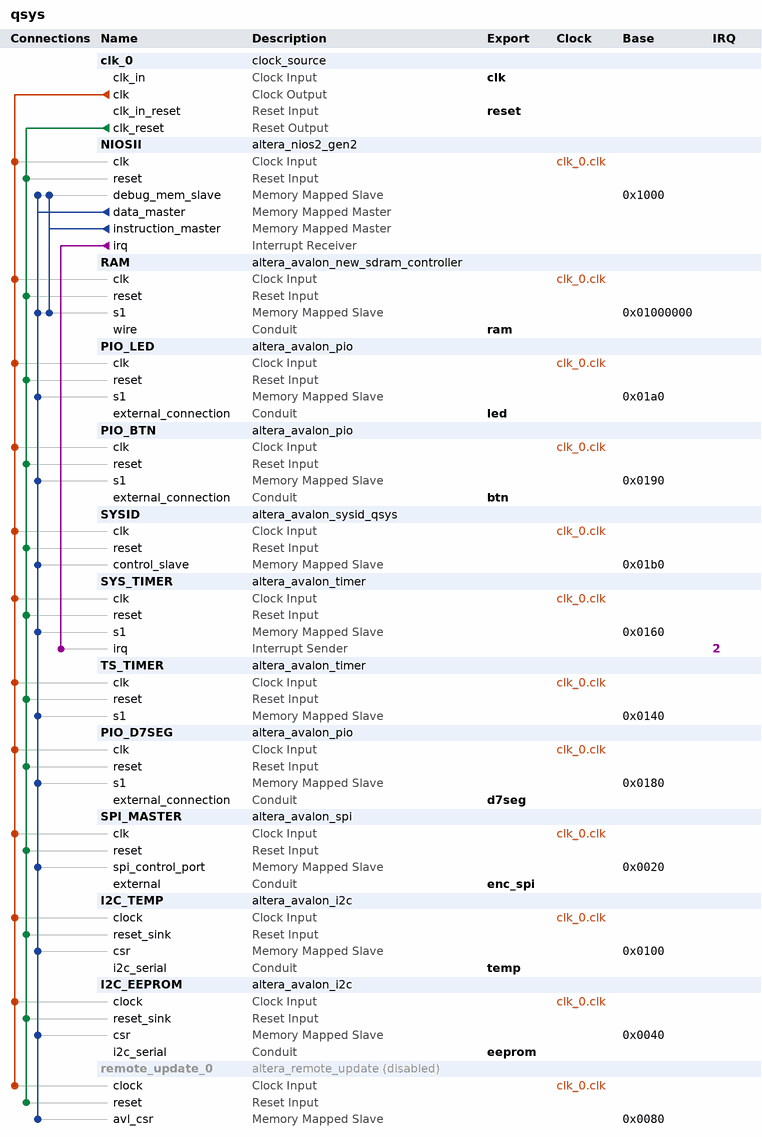
[diagram p0: system contents]
# Platform Designer (Qsys) system qsys, Cyclone IV E EP4CE6E22C8
# Parameters at their usual value, and those the tool derives, are not listed.
package require -exact qsys 20.1
create_system qsys
set_project_property DEVICE_FAMILY {Cyclone IV E}
set_project_property DEVICE EP4CE6E22C8

add_instance clk_0 clock_source 20.1
set_instance_parameter_value clk_0 clockFrequency 25000000

add_instance NIOSII altera_nios2_gen2 20.1
set_instance_parameter_value NIOSII dcache_size 0
set_instance_parameter_value NIOSII dividerType srt2
set_instance_parameter_value NIOSII exceptionSlave RAM.s1
set_instance_parameter_value NIOSII icache_size 0
set_instance_parameter_value NIOSII impl Tiny
set_instance_parameter_value NIOSII resetSlave RAM.s1

add_instance RAM altera_avalon_new_sdram_controller 20.1
set_instance_parameter_value RAM TAC 5.4
set_instance_parameter_value RAM TRCD 20.0
set_instance_parameter_value RAM TRP 20.0
set_instance_parameter_value RAM casLatency 2
set_instance_parameter_value RAM columnWidth 8
set_instance_parameter_value RAM dataWidth 16
set_instance_parameter_value RAM generateSimulationModel false
set_instance_parameter_value RAM model single_Micron_MT48LC4M32B2_7_chip
set_instance_parameter_value RAM numberOfBanks 4
set_instance_parameter_value RAM numberOfChipSelects 1
set_instance_parameter_value RAM powerUpDelay 100.0
set_instance_parameter_value RAM refreshPeriod 31.25
set_instance_parameter_value RAM rowWidth 12

add_instance PIO_LED altera_avalon_pio 20.1
set_instance_parameter_value PIO_LED direction Output
set_instance_parameter_value PIO_LED width 4

add_instance PIO_BTN altera_avalon_pio 20.1
set_instance_parameter_value PIO_BTN bitClearingEdgeCapReg true
set_instance_parameter_value PIO_BTN captureEdge true
set_instance_parameter_value PIO_BTN direction Input
set_instance_parameter_value PIO_BTN edgeType FALLING
set_instance_parameter_value PIO_BTN generateIRQ true
set_instance_parameter_value PIO_BTN irqType EDGE
set_instance_parameter_value PIO_BTN width 8

add_instance SYSID altera_avalon_sysid_qsys 20.1
set_instance_parameter_value SYSID id 233492483

add_instance SYS_TIMER altera_avalon_timer 20.1
set_instance_parameter_value SYS_TIMER period 10
set_instance_parameter_value SYS_TIMER periodUnits MSEC

add_instance TS_TIMER altera_avalon_timer 20.1
set_instance_parameter_value TS_TIMER period 100
set_instance_parameter_value TS_TIMER periodUnits USEC

add_instance PIO_D7SEG altera_avalon_pio 20.1
set_instance_parameter_value PIO_D7SEG direction Output
set_instance_parameter_value PIO_D7SEG width 16

add_instance SPI_MASTER altera_avalon_spi 20.1
set_instance_parameter_value SPI_MASTER clockPolarity 0
set_instance_parameter_value SPI_MASTER dataWidth 8
set_instance_parameter_value SPI_MASTER masterSPI true
set_instance_parameter_value SPI_MASTER numberOfSlaves 1
set_instance_parameter_value SPI_MASTER targetClockRate 20000000

add_instance I2C_TEMP altera_avalon_i2c 20.1
set_instance_parameter_value I2C_TEMP FIFO_DEPTH 8

add_instance I2C_EEPROM altera_avalon_i2c 20.1
set_instance_parameter_value I2C_EEPROM FIFO_DEPTH 8

add_instance remote_update_0 altera_remote_update 20.1
set_instance_property remote_update_0 ENABLED false
set_instance_parameter_value remote_update_0 CBX_AUTO_BLACKBOX ALL
set_instance_parameter_value remote_update_0 DEVICE EP4CE6E22C8
set_instance_parameter_value remote_update_0 GUI_config_device EPCS16
set_instance_parameter_value remote_update_0 check_app_pof false
set_instance_parameter_value remote_update_0 check_avalon_interface true
set_instance_parameter_value remote_update_0 m_support_write_config_check false
set_instance_parameter_value remote_update_0 operation_mode REMOTE

# connections
add_connection clk_0.clk I2C_EEPROM.clock clock
add_connection clk_0.clk I2C_TEMP.clock clock
add_connection clk_0.clk NIOSII.clk clock
add_connection clk_0.clk PIO_BTN.clk clock
add_connection clk_0.clk PIO_D7SEG.clk clock
add_connection clk_0.clk PIO_LED.clk clock
add_connection clk_0.clk RAM.clk clock
add_connection clk_0.clk remote_update_0.clock clock
add_connection clk_0.clk SPI_MASTER.clk clock
add_connection clk_0.clk SYS_TIMER.clk clock
add_connection clk_0.clk SYSID.clk clock
add_connection clk_0.clk TS_TIMER.clk clock
add_connection clk_0.clk_reset I2C_EEPROM.reset_sink reset
add_connection clk_0.clk_reset I2C_TEMP.reset_sink reset
add_connection clk_0.clk_reset NIOSII.reset reset
add_connection clk_0.clk_reset PIO_BTN.reset reset
add_connection clk_0.clk_reset PIO_D7SEG.reset reset
add_connection clk_0.clk_reset PIO_LED.reset reset
add_connection clk_0.clk_reset RAM.reset reset
add_connection clk_0.clk_reset remote_update_0.reset reset
add_connection clk_0.clk_reset SPI_MASTER.reset reset
add_connection clk_0.clk_reset SYS_TIMER.reset reset
add_connection clk_0.clk_reset SYSID.reset reset
add_connection clk_0.clk_reset TS_TIMER.reset reset
add_connection NIOSII.data_master I2C_EEPROM.csr avalon
set_connection_parameter_value NIOSII.data_master/I2C_EEPROM.csr baseAddress 0x0040
add_connection NIOSII.data_master I2C_TEMP.csr avalon
set_connection_parameter_value NIOSII.data_master/I2C_TEMP.csr baseAddress 0x0100
add_connection NIOSII.data_master NIOSII.debug_mem_slave avalon
set_connection_parameter_value NIOSII.data_master/NIOSII.debug_mem_slave baseAddress 0x1000
add_connection NIOSII.data_master PIO_BTN.s1 avalon
set_connection_parameter_value NIOSII.data_master/PIO_BTN.s1 baseAddress 0x0190
add_connection NIOSII.data_master PIO_D7SEG.s1 avalon
set_connection_parameter_value NIOSII.data_master/PIO_D7SEG.s1 baseAddress 0x0180
add_connection NIOSII.data_master PIO_LED.s1 avalon
set_connection_parameter_value NIOSII.data_master/PIO_LED.s1 baseAddress 0x01a0
add_connection NIOSII.data_master RAM.s1 avalon
set_connection_parameter_value NIOSII.data_master/RAM.s1 baseAddress 0x01000000
add_connection NIOSII.data_master remote_update_0.avl_csr avalon
set_connection_parameter_value NIOSII.data_master/remote_update_0.avl_csr baseAddress 0x0080
add_connection NIOSII.data_master SPI_MASTER.spi_control_port avalon
set_connection_parameter_value NIOSII.data_master/SPI_MASTER.spi_control_port baseAddress 0x0020
add_connection NIOSII.data_master SYS_TIMER.s1 avalon
set_connection_parameter_value NIOSII.data_master/SYS_TIMER.s1 baseAddress 0x0160
add_connection NIOSII.data_master SYSID.control_slave avalon
set_connection_parameter_value NIOSII.data_master/SYSID.control_slave baseAddress 0x01b0
add_connection NIOSII.data_master TS_TIMER.s1 avalon
set_connection_parameter_value NIOSII.data_master/TS_TIMER.s1 baseAddress 0x0140
add_connection NIOSII.instruction_master NIOSII.debug_mem_slave avalon
set_connection_parameter_value NIOSII.instruction_master/NIOSII.debug_mem_slave baseAddress 0x1000
add_connection NIOSII.instruction_master RAM.s1 avalon
set_connection_parameter_value NIOSII.instruction_master/RAM.s1 baseAddress 0x01000000
add_connection NIOSII.irq SYS_TIMER.irq interrupt
set_connection_parameter_value NIOSII.irq/SYS_TIMER.irq irqNumber 2

# exported interfaces
add_interface btn conduit end
set_interface_property btn EXPORT_OF PIO_BTN.external_connection
add_interface clk clock sink
set_interface_property clk EXPORT_OF clk_0.clk_in
add_interface d7seg conduit end
set_interface_property d7seg EXPORT_OF PIO_D7SEG.external_connection
add_interface eeprom conduit end
set_interface_property eeprom EXPORT_OF I2C_EEPROM.i2c_serial
add_interface enc_spi conduit end
set_interface_property enc_spi EXPORT_OF SPI_MASTER.external
add_interface led conduit end
set_interface_property led EXPORT_OF PIO_LED.external_connection
add_interface ram conduit end
set_interface_property ram EXPORT_OF RAM.wire
add_interface reset reset sink
set_interface_property reset EXPORT_OF clk_0.clk_in_reset
add_interface temp conduit end
set_interface_property temp EXPORT_OF I2C_TEMP.i2c_serial

set_interconnect_requirement {$system} qsys_mm.clockCrossingAdapter HANDSHAKE
set_interconnect_requirement {$system} qsys_mm.enableEccProtection FALSE
set_interconnect_requirement {$system} qsys_mm.insertDefaultSlave FALSE
set_interconnect_requirement {$system} qsys_mm.maxAdditionalLatency 1

save_system qsys.qsys
